# EAGLE board LR1302_LoRaWAN_Gateway_Module_V1.0_868SPI (EAGLE 9.5.1), part 1 of 2
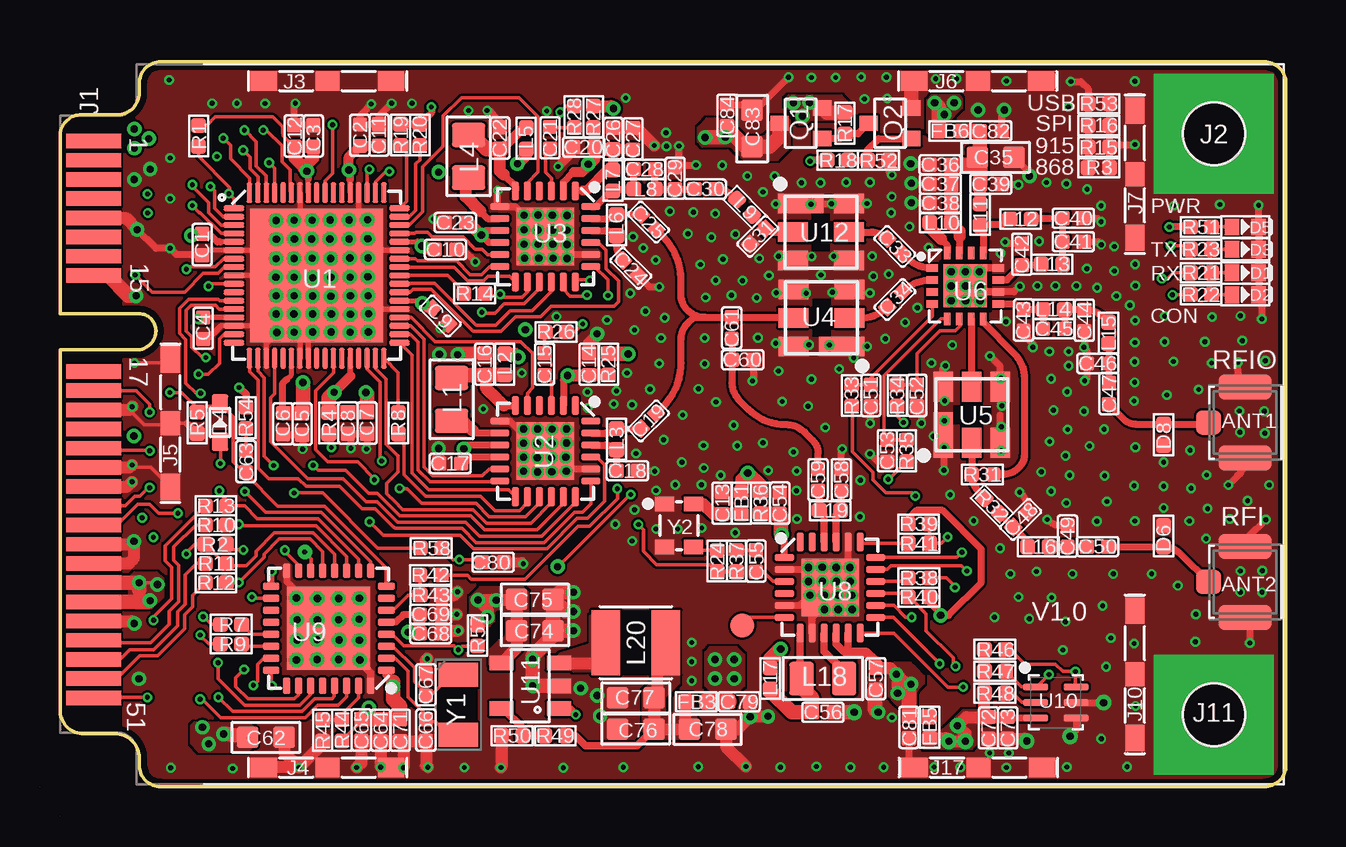
[diagram p5: board, top side]
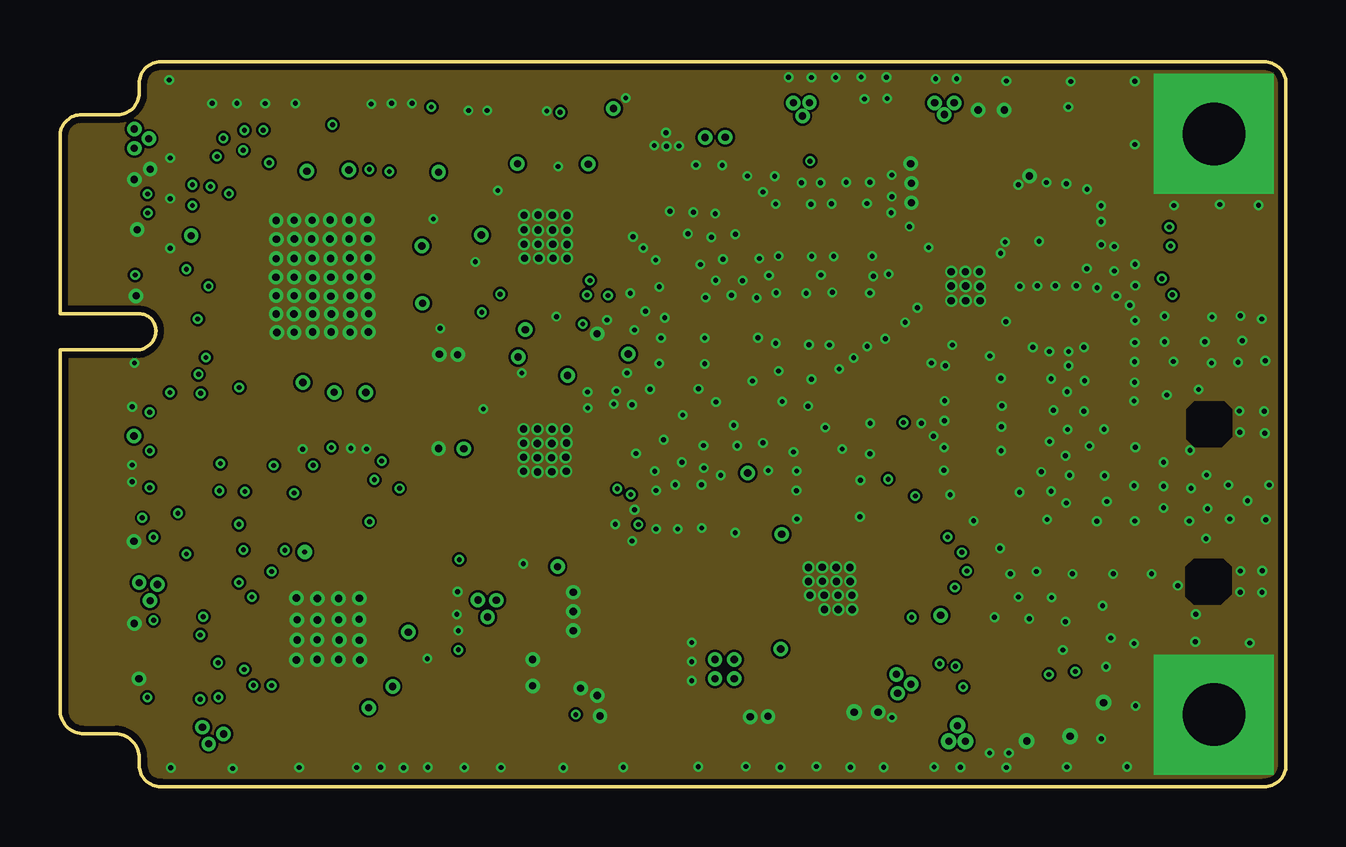
[diagram p6: board, inner layer Route2]
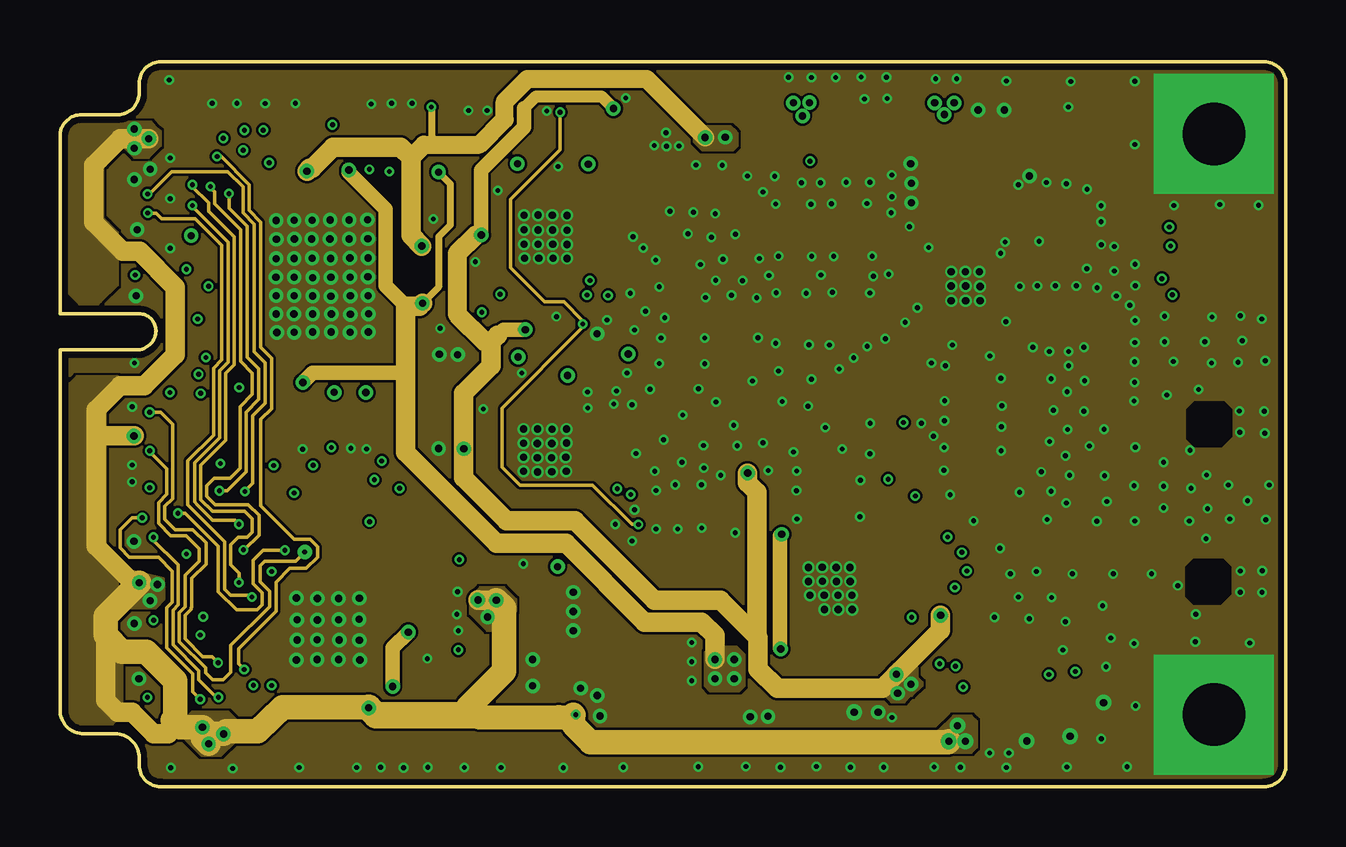
[diagram p7: board, inner layer Route15]
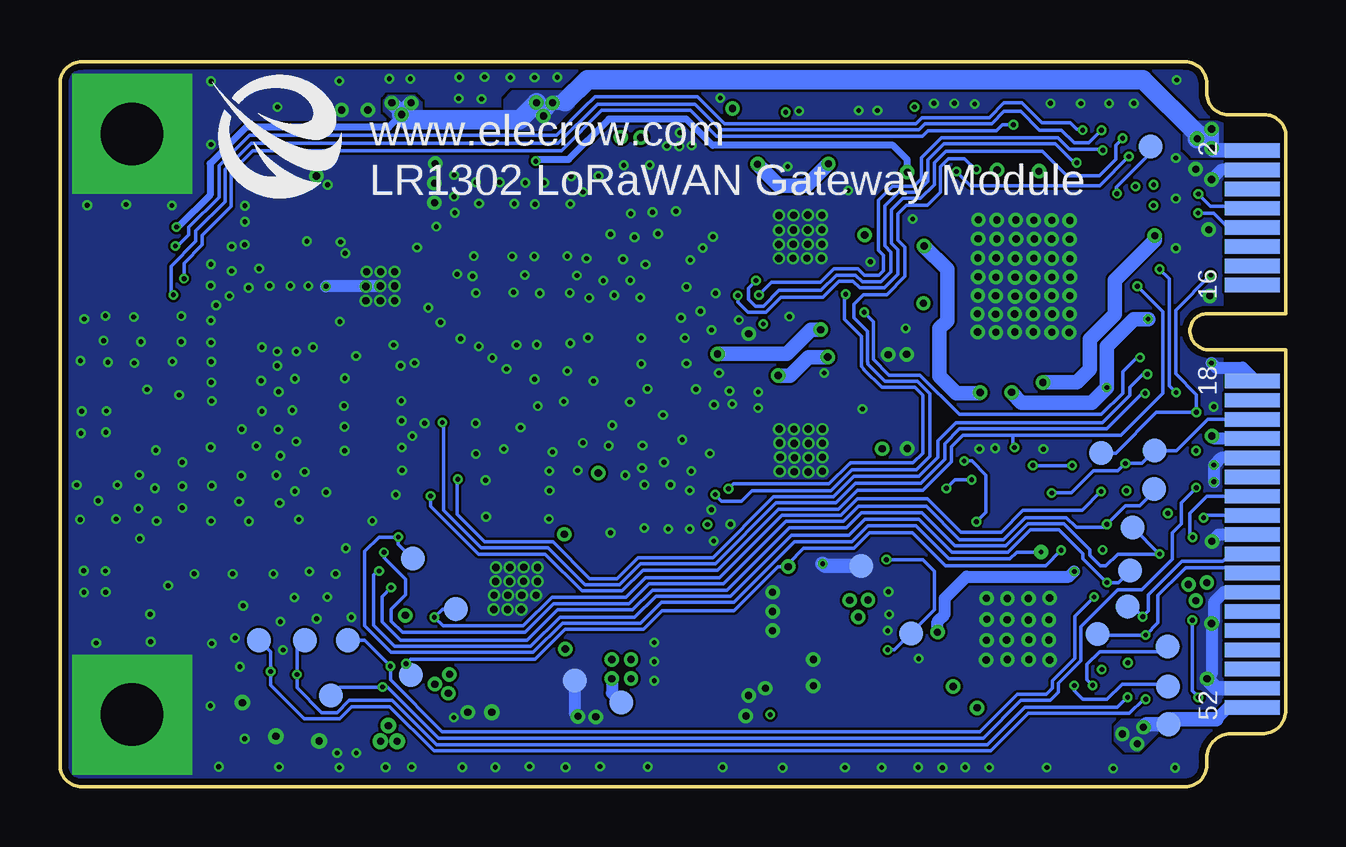
[diagram p8: board, bottom side, seen from below]

Size 51.1 x 30.2 mm. Coordinates in mm from the lower left corner, seen from the top.
Outline: 3.3,29.3 arc-90 4.2,30.2 50.2,30.2 arc-90 51.1,29.3 51.1,0.9 arc-90 50.2,0 4.2,0 arc-90 3.3,0.9 3.3,1.2 arc90 2.3,2.2 1,2.2 arc-90 0,3.2 0,18.2 3.2,18.2 arc90 4,19 arc90 3.3,19.7 0,19.7 0,27.1 arc-90 0.9,28 2.4,28 arc90 3.3,28.9 3.3,29.3
Copper layers (1+2*15+16): Top 0.035mm / dielectric 1.5mm / Route2 0.035mm / dielectric 0.15mm / Route15 0.035mm / dielectric 0.2mm / Bottom 0.035mm
Design rules "default *": minimum track width 6mil, minimum drill 0.2mm, track to track 4mil, track to pad 4mil, pad to pad 4mil, via to via 6mil, smd to smd 6mil, copper to edge 10mil, drill to drill 6mil, minimum pad ring 10mil, minimum via ring 4mil, stop-mask expansion 4mil, vias tented up to drill 100mil, thermal gap 10mil
Net classes: 1 ANT_50R: width 0.254 mm, clearance 0.381 mm
tRestrict: area 31.3,22.3 to 32.1,23.9; area 31.4,18.7 to 32.1,20.3; area 37.2,15.1 to 38.8,15.9; area 15.9,2.7 to 17.4,4.1; area 0,1.9 to 2.6,28.1; area 10,17.4 to 10.3,18.4
bRestrict: area 0,1.8 to 2.6,28.2

## Footprints (pad centres in the part's own frame; a part is rotated, then mirrored left to right if it is on the bottom)
U.FL-R-SMD = smd 1.05 x 1: 1 -1.525,0 | smd 2.2 x 1.05: 2 0,-1.475; 3 0,1.475
C0402 = smd 0.6 x 0.6: 1 -0.45,0; 2 0.45,0
C0603 = smd 0.889 x 0.889: 1 -0.762,0; 2 0.762,0
LED-0402 = smd 0.6 x 0.7: 1 -0.55,0; 2 0.55,0
D_SOD523 = smd 0.762 x 0.7: + -0.8,0; - 0.8,0
D0402 = smd 0.635 x 0.635: 1 -0.445,0; 2 0.445,0
L0402 = smd 0.635 x 0.635: 1 -0.445,0; 2 0.445,0
PCIE-MINI-S52 = smd 0.6 x 2.3: 1 3.2,1.4; 3 4,1.4; 5 4.8,1.4; 7 5.6,1.4; 9 6.4,1.4; 11 7.2,1.4; 13 8,1.4; 15 8.8,1.4; 17 12.8,1.4; 19 13.6,1.4; 21 14.4,1.4; 23 15.2,1.4; 25 16,1.4; 27 16.8,1.4; 29 17.6,1.4; 31 18.4,1.4; 33 19.2,1.4; 35 20,1.4; 37 20.8,1.4; 39 21.6,1.4; 41 22.4,1.4; 43 23.2,1.4; 45 24,1.4; 47 24.8,1.4; 49 25.6,1.4; 51 26.4,1.4 | smd 0.6 x 2.3 bottom: 2 3.6,1.4; 4 4.4,1.4; 6 5.2,1.4; 8 6,1.4; 10 6.8,1.4; 12 7.6,1.4; 14 8.4,1.4; 16 9.2,1.4; 18 13.2,1.4; 20 14,1.4; 22 14.8,1.4; 24 15.6,1.4; 26 16.4,1.4; 28 17.2,1.4; 30 18,1.4; 32 18.8,1.4; 34 19.6,1.4; 36 20.4,1.4; 38 21.2,1.4; 40 22,1.4; 42 22.8,1.4; 44 23.6,1.4; 46 24.4,1.4; 48 25.2,1.4; 50 26,1.4; 52 26.8,1.4
PAD-THO-2.6*5MM = drill 2.6 pad 5 square: 1 0,0
PBJ-ICSRC6508-SMD = smd 1 x 0.8: 1 0,0 | smd 1.1 x 0.8: 2 -2.65,0; 3 2.65,0
L0805 = smd 1.016 x 1.397: 1 -0.889,0; 2 0.889,0
L3015_SMD = smd 1.2 x 2.7: 1 -1.25,0; 2 1.25,0
TEST_PAD-1.0MM = smd 1 x 1: P$1 0,0
MOS_SOT323 = smd 0.635 x 0.762: 1 -0.635,-0.889; 2 0.635,-0.889; 3 0,0.889
R0402 = smd 0.635 x 0.635: 1 -0.445,0; 2 0.445,0
QFN68-7*7MM = smd 0.85 x 0.23: 1 -3.45,2.8; 2 -3.45,2.45; 3 -3.45,2.1; 4 -3.45,1.75; 5 -3.45,1.4; 6 -3.45,1.05; 7 -3.45,0.7; 8 -3.45,0.35; 9 -3.45,0; 10 -3.45,-0.35; 11 -3.45,-0.7; 12 -3.45,-1.05; 13 -3.45,-1.4; 14 -3.45,-1.75; 15 -3.45,-2.1; 16 -3.45,-2.45; 17 -3.45,-2.8; 35 3.45,-2.8; 36 3.45,-2.45; 37 3.45,-2.1; 38 3.45,-1.75; 39 3.45,-1.4; 40 3.45,-1.05; 41 3.45,-0.7; 42 3.45,-0.35; 43 3.45,0; 44 3.45,0.35; 45 3.45,0.7; 46 3.45,1.05; 47 3.45,1.4; 48 3.45,1.75; 49 3.45,2.1; 50 3.45,2.45; 51 3.45,2.8 | smd 0.23 x 0.85: 18 -2.8,-3.45; 19 -2.45,-3.45; 20 -2.1,-3.45; 21 -1.75,-3.45; 22 -1.4,-3.45; 23 -1.05,-3.45; 24 -0.7,-3.45; 25 -0.35,-3.45; 26 0,-3.45; 27 0.35,-3.45; 28 0.7,-3.45; 29 1.05,-3.45; 30 1.4,-3.45; 31 1.75,-3.45; 32 2.1,-3.45; 33 2.45,-3.45; 34 2.8,-3.45; 52 2.8,3.45; 53 2.45,3.45; 54 2.1,3.45; 55 1.75,3.45; 56 1.4,3.45; 57 1.05,3.45; 58 0.7,3.45; 59 0.35,3.45; 60 0,3.45; 61 -0.35,3.45; 62 -0.7,3.45; 63 -1.05,3.45; 64 -1.4,3.45; 65 -1.75,3.45; 66 -2.1,3.45; 67 -2.45,3.45; 68 -2.8,3.45 | smd 5.55 x 5.55: 69 0,0
QFN24-4*4MM = smd 0.8 x 0.3: 1 -1.9,1.25; 2 -1.9,0.75; 3 -1.9,0.25; 4 -1.9,-0.25; 5 -1.9,-0.75; 6 -1.9,-1.25; 13 1.9,-1.25; 14 1.9,-0.75; 15 1.9,-0.25; 16 1.9,0.25; 17 1.9,0.75; 18 1.9,1.25 | smd 0.3 x 0.8: 7 -1.25,-1.9; 8 -0.75,-1.9; 9 -0.25,-1.9; 10 0.25,-1.9; 11 0.75,-1.9; 12 1.25,-1.9; 19 1.25,1.9; 20 0.75,1.9; 21 0.25,1.9; 22 -0.25,1.9; 23 -0.75,1.9; 24 -1.25,1.9 | smd 2.4 x 2.4: 25 0,0
SAW-SMD6-3*3MM = smd 1.9 x 0.81: 1 -0.845,1.19 | smd 1.25 x 0.81: 2 -1.17,0; 3 -1.17,-1.19; 4 1.17,-1.19; 5 1.17,0; 6 1.17,1.19
MCM-16-EP(3X3) = smd 0.5 x 0.3: 1 -1.375,0.75; 2 -1.375,0.25; 3 -1.375,-0.25; 4 -1.375,-0.75; 9 1.375,-0.75; 10 1.375,-0.25; 11 1.375,0.25; 12 1.375,0.75 | smd 0.3 x 0.5: 5 -0.75,-1.375; 6 -0.25,-1.375; 7 0.25,-1.375; 8 0.75,-1.375; 13 0.75,1.375; 14 0.25,1.375; 15 -0.25,1.375; 16 -0.75,1.375 | smd 1.8 x 1.8: 17 0,0
UFQFPN-32-5*5MM = smd 0.7 x 0.3: 1 -2.4,1.75; 2 -2.4,1.25; 3 -2.4,0.75; 4 -2.4,0.25; 5 -2.4,-0.25; 6 -2.4,-0.75; 7 -2.4,-1.25; 8 -2.4,-1.75; 17 2.4,-1.75; 18 2.4,-1.25; 19 2.4,-0.75; 20 2.4,-0.25; 21 2.4,0.25; 22 2.4,0.75; 23 2.4,1.25; 24 2.4,1.75 | smd 0.3 x 0.6: 9 -1.75,-2.4; 10 -1.25,-2.4; 11 -0.75,-2.4; 12 -0.25,-2.4; 13 0.25,-2.4; 14 0.75,-2.4; 15 1.25,-2.4; 16 1.75,-2.4 | smd 0.3 x 0.7: 25 1.75,2.4; 26 1.25,2.4; 27 0.75,2.4; 28 0.25,2.4; 29 -0.25,2.4; 30 -0.75,2.4; 31 -1.25,2.4; 32 -1.75,2.4 | smd 3.45 x 3.45: 33 0,0
UDFN-6(2X2) = smd 1.05 x 0.3: 1 -0.85,0.65; 2 -0.85,0; 3 -0.85,-0.65; 4 0.85,-0.65; 5 0.85,0; 6 0.85,0.65
IC_SOT23-5 = smd 0.6 x 1: 1 -0.95,-1.2; 2 0,-1.2; 3 0.95,-1.2; 4 0.95,1.2; 5 -0.95,1.2
XATL-3215-SMD = smd 1 x 1.65: 1 -1.25,0; 2 1.25,0
TXCO-SMD2.0*1.6 = smd 0.6 x 0.8: 1 -0.9,-0.6; 2 0.9,-0.6; 3 0.9,0.6; 4 -0.9,0.6

## Placement (x,y rotation side)
ANT1  U.FL_SMTU.FL-R-SMD  [U.FL-R-SMD]  49.4,15.17 0 top
ANT2  NC  [U.FL-R-SMD]  49.4,8.53 0 top
C1  100nF  [C0402]  5.92,22.59 90 top
C2  1uF  [C0402]  12.5,27.14 270 top
C3  100nF  [C0402]  10.56,27.11 270 top
C4  1uF  [C0402]  5.97,19.1 90 top
C5  100nF  [C0402]  10.09,15.11 90 top
C6  1uF  [C0402]  9.29,15.12 90 top
C7  100nF  [C0402]  12.8,15.15 90 top
C8  1uF  [C0402]  12,15.15 90 top
C9  100nF  [C0402]  15.85,19.61 135 top
C10  100nF  [C0402]  16.07,22.38 180 top
C11  100nF  [C0402]  13.3,27.15 270 top
C12  100nF  [C0402]  9.76,27.11 270 top
C13  100nF  [C0402]  27.6,11.81 270 top
C14  1uF  [C0402]  22.05,17.6 90 top
C15  10pF  [C0402]  20.2,17.6 270 top
C16  470nF  [C0402]  17.7,17.6 90 top
C17  100nF  [C0402]  16.26,13.47 0 top
C18  3.6pF  [C0402]  23.65,13.16 180 top
C19  3.6pF  [C0402]  24.53,15.24 225 top
C20  1uF  [C0402]  21.83,26.64 180 top
C21  10pF  [C0402]  20.43,27.03 270 top
C22  470nF  [C0402]  18.33,27.02 90 top
C23  100nF  [C0402]  16.48,23.51 0 top
C24  3.6pF  [C0402]  23.79,21.6 135 top
C25  3.6pF  [C0402]  24.53,23.52 135 top
C26  47nF  [C0402]  23.05,27 90 top
C27  47pF  [C0402]  23.88,27 90 top
C28  3.3pF  [C0402]  24.37,25.73 180 top
C29  5.6pF  [C0402]  25.64,25.35 90 top
C30  39pF  [C0402]  26.89,24.9 0 top
C31  2.2pF  [C0402]  29.09,22.93 225 top
C33  56pF  [C0402]  34.8,22.51 315 top
C34  56pF  [C0402]  34.8,20.3 45 top
C35  4.7uF  [C0603]  39,26.22 180 top
C36  10nF  [C0402]  36.69,25.92 0 top
C37  1nF  [C0402]  36.7,25.1 0 top
C38  100pF  [C0402]  36.7,24.31 0 top
C39  100pF  [C0402]  38.8,25.1 180 top
C40  10pF  [C0402]  42.24,23.68 180 top
C41  NC  [C0402]  42.24,22.71 180 top
C42  1.3pF  [C0402]  40.09,22.18 270 top
C43  3.3pF  [C0402]  40.16,19.44 90 top
C44  3.3pF  [C0402]  42.69,19.43 90 top
C45  1.5pF  [C0402]  41.43,19.09 180 top
C46  2.7pF  [C0402]  43.26,17.63 0 top
C47  56pF  [C0402]  43.72,16.38 90 top
C48  NC  [C0402]  40.05,11.14 225 top
C49  NC  [C0402]  42,10.44 270 top
C50  NC  [C0402]  43.25,10 180 top
C51  56pF  [C0402]  33.8,16.3 270 top
C52  56pF  [C0402]  35.72,16.3 270 top
C53  56pF  [C0402]  34.48,14 270 top
C54  NC  [C0402]  30,11.82 90 top
C55  NC  [C0402]  29.02,9.4 270 top
C56  NC  [C0402]  31.8,3.1 0 top
C57  NC  [C0402]  34,4.5 90 top
C58  NC  [C0402]  32.57,12.79 270 top
C59  NC  [C0402]  31.6,12.79 270 top
C60  NC  [C0402]  28.46,17.78 180 top
C61  NC  [C0402]  28,19.11 270 top
C62  4.7uF  [C0603]  8.58,2.05 180 top
C63  100nF  [C0402]  7.75,13.55 270 top
C64  NC  [C0402]  13.37,2.35 90 top
C65  NC  [C0402]  12.56,2.36 90 top
C66  NC  [C0402]  15.25,2.36 90 top
C67  NC  [C0402]  15.25,4.25 90 top
C68  NC  [C0402]  15.45,6.38 180 top
C69  NC  [C0402]  15.44,7.17 180 top
C71  NC  [C0402]  14.18,2.35 90 top
C72  100nF  [C0402]  38.7,2.45 90 top
C73  2.2uF  [C0402]  39.5,2.45 90 top
C74  22uF  [C0603]  19.8,6.5 180 top
C75  22uF  [C0603]  19.79,7.82 180 top
C76  22uF  [C0603]  24,2.4 0 top
C77  22uF  [C0603]  24,3.7 0 top
C78  4.7uF  [C0603]  27,2.38 180 top
C79  100nF  [C0402]  28.31,3.54 180 top
C80  NC  [C0402]  18.05,9.35 180 top
C81  100nF  [C0402]  35.38,2.47 90 top
C82  100nF  [C0402]  38.8,27.32 180 top
C83  4.7uF  [C0603]  28.85,27.42 270 top
C84  100nF  [C0402]  27.8,27.97 270 top
D1  BLUE  [LED-0402]  49.41,21.41 0 top
D2  RED  [LED-0402]  49.41,20.5 0 top
D3  GREEN  [LED-0402]  49.41,22.39 0 top
D4  BAT54XV2T1G  [D_SOD523]  6.67,15.17 90 top
D5  GREEN  [LED-0402]  49.41,23.32 0 top
D6  LXES15AAA1-153  [D0402]  46,10.44 90 top
D8  LXES15AAA1-153  [D0402]  46,14.66 270 top
FB1  FB  [L0402]  28.4,11.81 270 top
FB3  FB  [L0402]  26.52,3.54 0 top
FB5  FB  [L0402]  36.25,2.47 90 top
FB6  FB  [L0402]  37.09,27.32 0 top
J1  PCI-EXPRESS-CARD-P52  [PCIE-MINI-S52]  0,30.1 270 top
J2  PAD-THO-2.65MM  [PAD-THO-2.6*5MM]  48.1,27.2 0 top
J3  PBJ-ICSRC6508-SMD  [PBJ-ICSRC6508-SMD]  11.15,29.4 0 top
J4  PBJ-ICSRC6508-SMD  [PBJ-ICSRC6508-SMD]  11.15,0.8 0 top
J5  PBJ-ICSRC6508-SMD  [PBJ-ICSRC6508-SMD]  4.6,15.14 90 top
J6  PBJ-ICSRC6508-SMD  [PBJ-ICSRC6508-SMD]  38.25,29.4 0 top
J7  PBJ-ICSRC6508-SMD  [PBJ-ICSRC6508-SMD]  44.8,25.52 90 top
J10  PBJ-ICSRC6508-SMD  [PBJ-ICSRC6508-SMD]  44.8,4.68 90 top
J11  PAD-THO-2.65MM  [PAD-THO-2.6*5MM]  48.1,3 0 top
J17  PBJ-ICSRC6508-SMD  [PBJ-ICSRC6508-SMD]  38.28,0.8 0 top
L1  15uH  [L0805]  16.32,16.14 270 top
L2  NC  [L0402]  18.54,17.6 90 top
L3  12nH  [L0402]  23.2,14.48 90 top
L4  15uH  [L0805]  17.03,26.27 270 top
L5  NC  [L0402]  19.43,27.02 270 top
L6  12nH  [L0402]  23.2,23.4 90 top
L7  47nH  [L0402]  23.05,25.26 90 top
L8  2.5nH  [L0402]  24.37,24.9 0 top
L9  4.7nH  [L0402]  28.53,24.15 315 top
L10  1.2nH  [L0402]  36.7,23.5 0 top
L11  6.8nH  [L0402]  38.35,23.84 90 top
L12  3.0nH  [L0402]  40.04,23.66 0 top
L13  7.5nH  [L0402]  41.34,21.77 180 top
L14  5.6nH  [L0402]  41.42,19.89 0 top
L15  5.6nH  [L0402]  43.7,18.91 270 top
L16  NC  [L0402]  40.78,9.99 0 top
L17  NC  [L0402]  29.6,4.5 90 top
L18  NC  [L0805]  31.8,4.5 0 top
L19  NC  [L0402]  32.1,11.5 180 top
L20  2.2uH  [L3015_SMD]  24,6 0 top
P1  TEST_PADPAD-1.0MM  [TEST_PAD-1.0MM]  6.6,7.5 0 bottom
P2  TEST_PADPAD-1.0MM  [TEST_PAD-1.0MM]  7.86,6.37 0 bottom
P3  TEST_PADPAD-1.0MM  [TEST_PAD-1.0MM]  4.92,4.18 0 bottom
P4  TEST_PADPAD-1.0MM  [TEST_PAD-1.0MM]  4.93,5.84 90 bottom
P5  TEST_PADPAD-1.0MM  [TEST_PAD-1.0MM]  28.43,6.72 0 top
P6  TEST_PADPAD-1.0MM  [TEST_PAD-1.0MM]  15.63,6.39 0 bottom
P7  TEST_PADPAD-1.0MM  [TEST_PAD-1.0MM]  4.9,2.6 0 bottom
P8  TEST_PADPAD-1.0MM  [TEST_PAD-1.0MM]  17.7,9.2 0 bottom
P9  TEST_PADPAD-1.0MM  [TEST_PAD-1.0MM]  5.5,12.4 0 bottom
P10  TEST_PADPAD-1.0MM  [TEST_PAD-1.0MM]  6.4,10.8 0 bottom
P11  TEST_PADPAD-1.0MM  [TEST_PAD-1.0MM]  6.5,9 0 bottom
P12  TEST_PADPAD-1.0MM  [TEST_PAD-1.0MM]  5.65,26.68 0 bottom
P13  TEST_PADPAD-1.0MM  [TEST_PAD-1.0MM]  36.4,9.5 0 bottom
P14  TEST_PADPAD-1.0MM  [TEST_PAD-1.0MM]  39.8,3.8 0 bottom
P15  TEST_PADPAD-1.0MM  [TEST_PAD-1.0MM]  36.48,4.66 0 bottom
P16  TEST_PADPAD-1.0MM  [TEST_PAD-1.0MM]  40.9,6.1 0 bottom
P17  TEST_PADPAD-1.0MM  [TEST_PAD-1.0MM]  34.6,7.4 0 bottom
P18  TEST_PADPAD-1.0MM  [TEST_PAD-1.0MM]  39.1,6.1 0 bottom
P19  TEST_PADPAD-1.0MM  [TEST_PAD-1.0MM]  42.8,6.1 0 bottom
P20  TEST_PADPAD-1.0MM  [TEST_PAD-1.0MM]  5.48,14 0 bottom
P21  TEST_PADPAD-1.0MM  [TEST_PAD-1.0MM]  7.7,13.9 0 bottom
P23  TEST_PADPAD-1.0MM  [TEST_PAD-1.0MM]  27.7,3.5 90 bottom
P24  TEST_PADPAD-1.0MM  [TEST_PAD-1.0MM]  29.65,4.43 90 bottom
Q1  CJ2101  [MOS_SOT323]  30.88,27.64 90 top
Q2  CJ2102  [MOS_SOT323]  34.6,27.64 90 top
R1  47K  [R0402]  5.78,27.11 90 top
R2  100R  [R0402]  6.5,10.1 180 top
R3  868M  [R0402]  43.3,25.79 180 top
R4  47K  [R0402]  11.2,15.15 90 top
R5  47K  [R0402]  5.72,15.16 90 top
R7  NC  [R0402]  7.13,6.76 0 top
R8  0R  [R0402]  14.1,15.15 270 top
R9  NC  [R0402]  7.13,5.95 0 top
R10  0R  [R0402]  6.5,10.9 180 top
R11  0R  [R0402]  6.5,9.3 180 top
R12  0R  [R0402]  6.5,8.5 180 top
R13  0R  [R0402]  6.5,11.7 180 top
R14  0R  [R0402]  17.28,20.55 0 top
R15  NC  [R0402]  43.3,26.65 180 top
R16  SPI  [R0402]  43.3,27.55 180 top
R17  10K  [R0402]  32.72,27.64 90 top
R18  100R  [R0402]  32.41,26.1 180 top
R19  4.7K  [R0402]  14.2,27.16 90 top
R20  4.7K  [R0402]  15,27.16 90 top
R21  3.3K  [R0402]  47.56,21.41 0 top
R22  2K  [R0402]  47.56,20.5 0 top
R23  680R  [R0402]  47.56,22.39 0 top
R24  0R  [R0402]  27.39,9.4 270 top
R25  0R  [R0402]  22.86,17.6 90 top
R26  220R  [R0402]  20.67,18.95 0 top
R27  0R  [R0402]  22.23,27.91 90 top
R28  220R  [R0402]  21.43,27.91 90 top
R31  0R  [R0402]  38.45,13.01 180 top
R32  NC  [R0402]  38.85,11.7 315 top
R33  100R  [R0402]  33,16.3 90 top
R34  100R  [R0402]  34.9,16.3 90 top
R35  100R  [R0402]  35.29,14 90 top
R36  NC  [R0402]  29.2,11.82 90 top
R37  NC  [R0402]  28.2,9.4 270 top
R38  NC  [R0402]  35.8,8.7 180 top
R39  NC  [R0402]  35.79,10.94 180 top
R40  NC  [R0402]  35.81,7.89 0 top
R41  NC  [R0402]  35.8,10.14 180 top
R42  NC  [R0402]  15.44,8.82 180 top
R43  NC  [R0402]  15.46,7.98 0 top
R44  NC  [R0402]  11.75,2.35 270 top
R45  NC  [R0402]  10.95,2.35 90 top
R46  4.7K  [R0402]  38.97,5.72 180 top
R47  4.7K  [R0402]  38.97,4.81 180 top
R48  47K  [R0402]  38.97,3.89 180 top
R49  59K 1%  [R0402]  20.64,2.12 180 top
R50  59K 1%  [R0402]  18.84,2.12 180 top
R51  680R  [R0402]  47.56,23.32 0 top
R52  100K  [R0402]  34.11,26.1 0 top
R53  NC  [R0402]  43.3,28.46 180 top
R54  10R  [R0402]  7.75,15.37 90 top
R57  NC  [R0402]  17.4,6.3 90 top
R58  NC  [R0402]  15.47,9.94 180 top
U1  SX1302IMLTRT  [QFN68-7*7MM]  10.7,21.3 0 top
U2  SX1250IMLTRT  [QFN24-4*4MM]  20.23,13.98 270 top
U3  SX1250IMLTRT  [QFN24-4*4MM]  20.23,22.92 270 top
U4  TA0801A-SAW-868MHZ  [SAW-SMD6-3*3MM]  31.73,19.53 180 top
U5  TA0801A-SAW-868MHZ  [SAW-SMD6-3*3MM]  38,15.5 90 top
U6  SKY66420-11  [MCM-16-EP(3X3)]  37.73,20.87 0 top
U8  NC  [QFN24-4*4MM]  32.1,8.3 0 top
U9  NC  [UFQFPN-32-5*5MM]  11.2,6.6 180 top
U10  STTS751  [UDFN-6(2X2)]  41.51,3.51 0 top
U11  MT3520B  [IC_SOT23-5]  19.6,4.2 90 top
U12  TA0801A-SAW-868MHZ  [SAW-SMD6-3*3MM]  31.72,23.11 0 top
U$160  [ELECROW-NEW]  44.79,24.51 0 bottom
Y1  NC  [XATL-3215-SMD]  16.6,3.41 270 top
Y2  TCXO-32MHZ  [TXCO-SMD2.0*1.6]  25.8,10.88 270 top